# EAGLE design motordriver (EAGLE 6.5.0)
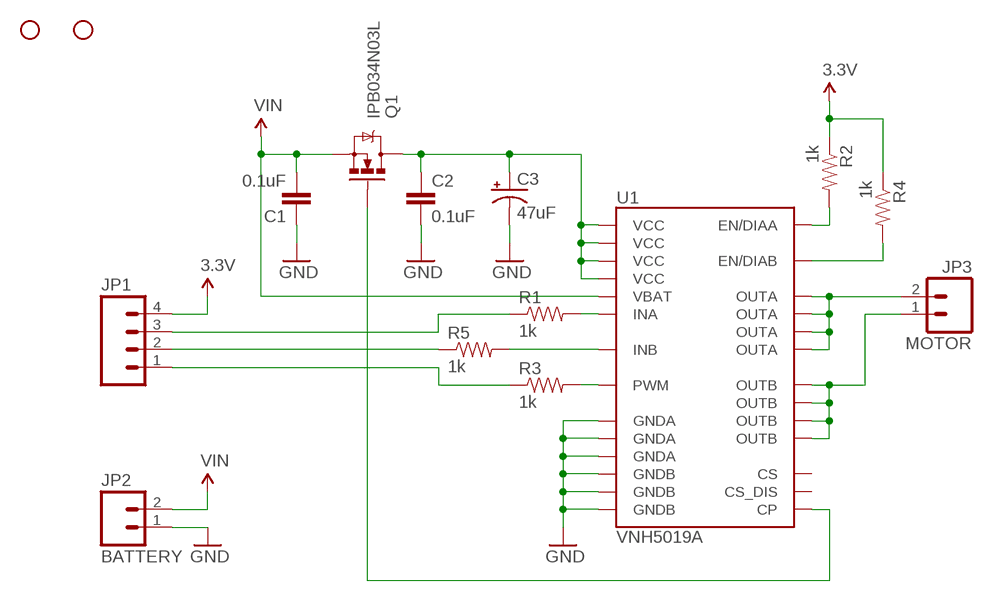
[diagram p0: schematic, sheet 1]

## Parts
C1  0.1uF  CAP0805  [0805]
C2  0.1uF  CAP0805  [0805]
C3  47uF  CAP_POLPTH1  [CPOL-RADIAL-100UF-25V]
JP1  M04POLAR_LOCK  [MOLEX-1X4_LOCK]
JP2  BATTERY  M025MM  [SCREWTERMINAL-5MM-2]
JP3  MOTOR  M025MM  [SCREWTERMINAL-5MM-2]
Q1  IPB034N03L  MOSFET-NCHANNELFDD8780  [DPAK]
R1  1k  RESISTOR0805-RES  [0805]
R2  1k  RESISTOR0805-RES  [0805]
R3  1k  RESISTOR0805-RES  [0805]
R4  1k  RESISTOR0805-RES  [0805]
R5  1k  RESISTOR0805-RES  [0805]
STANDOFF1  STAND-OFF  [STAND-OFF]
STANDOFF2  STAND-OFF  [STAND-OFF]
U1  VNH5019A  [MULTIPOWERSO-30]

## Nets
3.3V: JP1.4 R2.1 R4.1
GND: C1.1 C2.2 C3.2(-) JP2.1 U1.18(GNDB) U1.19(GNDB) U1.20(GNDB) U1.26(GNDA) U1.27(GNDA) U1.28(GNDA)
N$1: R1.2 U1.4(INA)
N$2: R5.2 U1.10(INB)
N$3: R3.2 U1.7(PWM)
N$4: Q1.1(G) U1.11(CP)
N$5: JP1.2 R5.1
N$7: JP1.3 R1.1
N$8: JP1.1 R3.1
N$9: R2.2 U1.5(EN/DIAA)
N$11: R4.2 U1.9(EN/DIAB)
OUTA: JP3.2 U1.1(OUTA) U1.25(OUTA) U1.30(OUTA) U1.SLUG3(OUTA)
OUTB: JP3.1 U1.15(OUTB) U1.16(OUTB) U1.21(OUTB) U1.SLUG2(OUTB)
VCC: C2.1 C3.1(+) Q1.4(D) U1.3(VCC) U1.13(VCC) U1.23(VCC) U1.SLUG1(VCC)
VIN: C1.2 JP2.2 Q1.3(S) U1.12(VBAT)
Unconnected: U1.6(CS_DIS) U1.8(CS)

## Library data of the parts
C1 C2 = SparkFun-Capacitors:CAP: Capacitor Standard 0603 ceramic capacitor, and 0.1" leaded capacitor.
C3 = SparkFun-Capacitors:CAP_POL: Capacitor Polarized These are standard SMD and PTH capacitors. Normally 10uF, 47uF, and 100uF in electrolytic and tantalum varieties. Always verify the external diameter of the through hole cap, it varies with capacity, voltage, and manufacturer. The EIA devices should be standard.
JP1 = SparkFun-Connectors:M04: Header 4 Standard 4-pin 0.1" header. Use with straight break away headers (SKU : PRT-00116), right angle break away headers (PRT-00553), swiss pins (PRT-00743), machine pins (PRT-00117), and female headers (PRT-00115). Molex polarized connector foot print use with SKU : PRT-08231 with associated crimp pins and housings. 1MM SMD Version SKU: PRT-10208
JP2 JP3 = SparkFun-Connectors:M02: Standard 2-pin 0.1" header. Use with - straight break away headers ( PRT-00116) - right angle break away headers (PRT-00553) - swiss pins (PRT-00743) - machine pins (PRT-00117) - female headers (PRT-00115) Molex polarized connector foot print use with: PRT-08233 with associated crimp pins and housings. 2.54_SCREWTERM for use with PRT-10571. 3.5mm Screw Terminal footprints for PRT-08084 5mm Screw Terminal footprints for use with PRT-08433
Q1 = SparkFun-DiscreteSemi:MOSFET-NCHANNEL: Common NMOSFET Parts MFG P/N Store ID Prod ID FDD8780 TRANS-09984 SI7820DN TRANS-11055 FDS6630A IC-08089 2N7002PW TRANS-11151 FQP30N06L COM-10213 TRANS-10060 BSS123LT1G TRANS-08345 BSS138 TRANS-00830 BS170 2N7000; PROD_ID: TRANS-09984
R1-R5 = SparkFun-Resistors:RESISTOR: Resistor Basic schematic elements and footprints for 0603, 1206, and PTH resistors.
STANDOFF1 STANDOFF2 = SparkFun-Electromechanical:STAND-OFF: #4 Stand Off This is the mechanical footprint for a #4 phillips button head screw. Use the keepout ring to avoid running the screw head into surrounding components. SKU : PRT-00447
U1 = Custom:VNH5019A

## Board
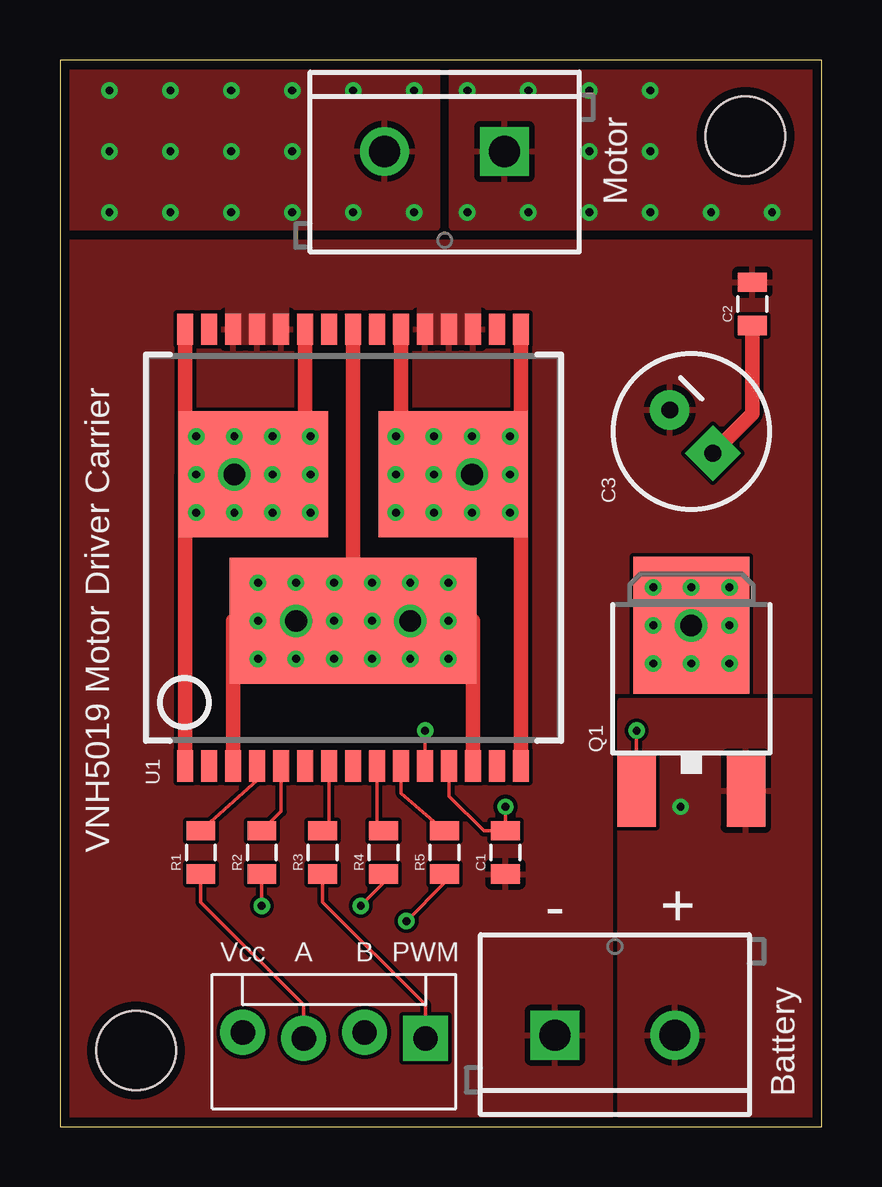
[diagram p1: board, top side]
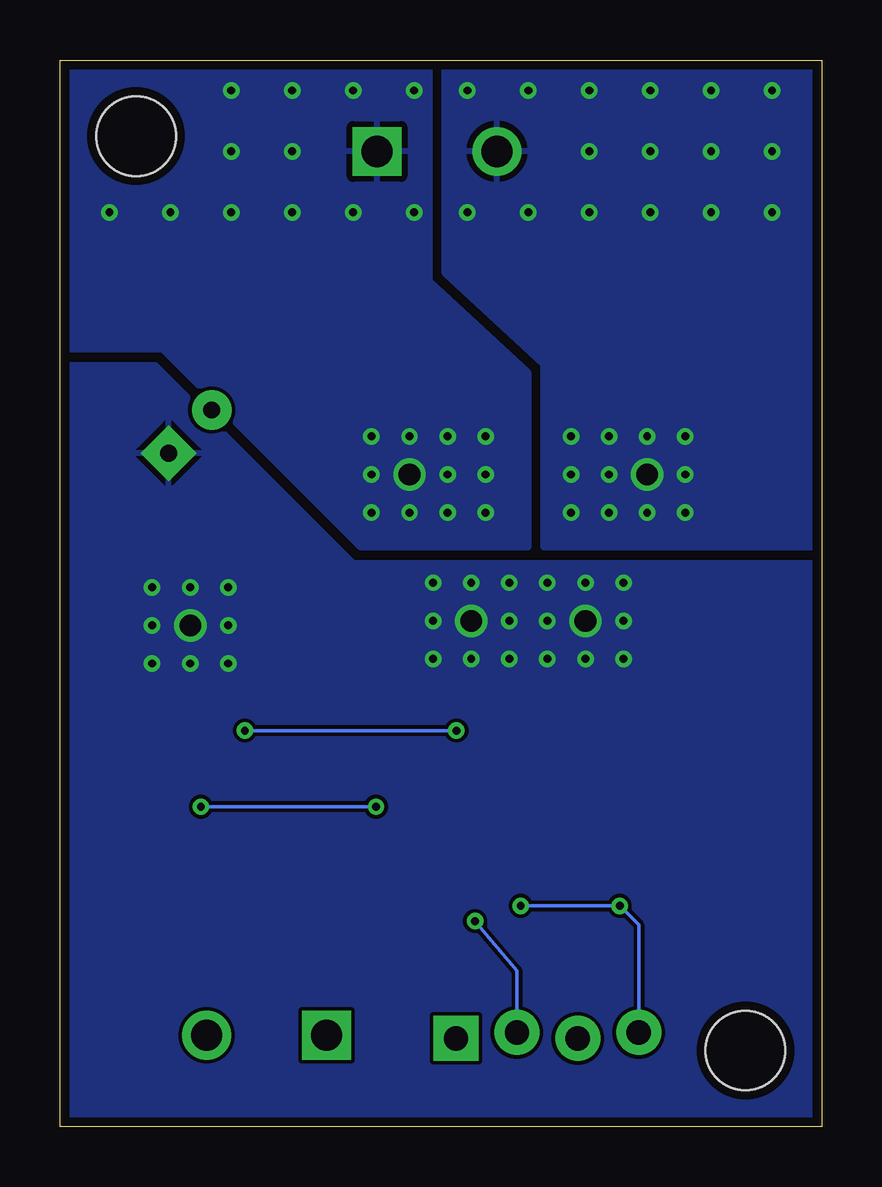
[diagram p2: board, bottom side, seen from below]

Size 31.75 x 44.45 mm. Coordinates in mm from the lower left corner, seen from the top.
Outline: 0,0 31.75,0 31.75,44.45 0,44.45 0,0
Copper layers (1*16): Top 0.0356mm / dielectric 1.5011mm / Bottom 0.0356mm
Design rules "LaenPCBOrder": minimum track width 6mil, minimum drill 13mil, track to track 6mil, track to pad 6mil, pad to pad 6mil, via to via 6mil, smd to smd 6mil, copper to edge 15mil, drill to drill 6mil, minimum pad ring 7mil, minimum via ring 7mil, stop-mask expansion 3mil, vias tented up to drill 0mil, thermal gap 10mil

### Footprints (pad centres in the part's own frame; a part is rotated, then mirrored left to right if it is on the bottom)
0805 = smd 0.8 x 1.2: 1 -0.9,0; 2 0.9,0
CPOL-RADIAL-100UF-25V = drill 0.7 pad 1.651 square: 1 1.27,0 | drill 0.7 pad 1.651: 2 -1.27,0
MOLEX-1X4_LOCK = drill 1.016 pad 1.88 square: 1 0,0.127 | drill 1.016 pad 1.88: 2 2.54,-0.127; 3 5.08,0.127; 4 7.62,-0.127
SCREWTERMINAL-5MM-2 = drill 1.3 pad 2.032 square: 1 0,0 | drill 1.3 pad 2.032: 2 5,0
DPAK = smd 1.6 x 3: 1 -2.28,-5.31; 3 2.28,-5.31 | smd 4.826 x 5.715: 4 0,1.588
STAND-OFF = hole 3.302: 0,0
MULTIPOWERSO-30 = smd 0.67 x 1.3: 1 -7,-9.1; 2 -6,-9.1; 3 -5,-9.1; 4 -4,-9.1; 5 -3,-9.1; 6 -2,-9.1; 7 -1,-9.1; 8 0,-9.1; 9 1,-9.1; 10 2,-9.1; 11 3,-9.1; 12 4,-9.1; 13 5,-9.1; 14 6,-9.1; 15 7,-9.1; 16 7,9.1; 17 6,9.1; 18 5,9.1; 19 4,9.1; 20 3,9.1; 21 2,9.1; 22 1,9.1; 23 0,9.1; 24 -1,9.1; 25 -2,9.1; 26 -3,9.1; 27 -4,9.1; 28 -5,9.1; 29 -6,9.1; 30 -7,9.1 | smd 10.3 x 5.25: SLUG1 0,-3.05 | smd 6.23 x 5.25: SLUG2 4.165,3.05; SLUG3 -4.165,3.05

### Placement (x,y rotation side)
C1  18.57,11.43 90 top
C2  28.86,34.29 90 top
C3  26.32,28.97 315 top
JP1  15.24,3.81 180 top
JP2  20.64,3.81 0 top
JP3  18.54,40.64 180 top
Q1  26.32,19.3 0 top
R1  5.87,11.43 90 top
R2  8.41,11.43 90 top
R3  10.95,11.43 90 top
R4  13.49,11.43 90 top
R5  16.03,11.43 90 top
STANDOFF1  3.17,3.17 0 top
STANDOFF2  28.57,41.27 0 top
U1  12.22,24.13 0 top

### Tracks (layer width: path | path; a pad name or v marks a point on that pad's centre or on a via)
3.3V  (via drill 0.33)
  Top 0.152: v8.41,9.21 R2.1 | R4.1 13.49,10.16 v12.54,9.21
  Bottom 0.152: v12.54,9.21 v8.41,9.21 7.62,8.41 JP1.4
GND
  pour Top: 0,0 22.96,0 22.96,18.16 31.75,18.16 31.75,36.83 0,36.83
  pour Top (no thermals): 6.89,32.58 9.56,32.58 9.56,34.29 6.89,34.29
  pour Top (no thermals): 14.89,32.58 17.56,32.58 17.56,34.29 14.89,34.29
N$1
  Top 0.152: R1.2 8.22,14.43 U1.4
N$2
  Top 0.152: R5.2 14.22,13.89 U1.10
N$3
  Top 0.152: R3.2 11.22,12.35 U1.7
N$4  (via drill 0.33)
  Top 0.152: U1.11 v15.22,16.51 | v24.04,16.51 Q1.1
  Bottom 0.152: v15.22,16.51 v24.04,16.51
N$5  (via drill 0.33)
  Top 0.152: v14.45,8.57 16.03,10.16 R5.1
  Bottom 0.152: v14.45,8.57 12.7,6.51 JP1.2
N$7
  Top 0.152: R1.1 5.87,9.37 10.16,5.08 JP1.3
N$8
  Top 0.152: R3.1 10.95,9.37 15.24,5.08 JP1.1
N$9
  Top 0.152: R2.2 9.22,13.14 U1.5
N$11
  Top 0.152: R4.2 13.22,12.6 U1.9
OUTA  (via drill 0.33, 0.9)
  Top 0.152: v7.27,27.18 7.27,27.05 U1.SLUG3
  Top 0.61: U1.25 10.22,29.34 U1.SLUG3 5.22,27.18 | U1.1 5.22,27.18 | U1.30 5.22,27.18
  other vias: 4.6,40.64 9.68,40.64 7.14,38.1 2.06,38.1 2.06,43.18 7.14,43.18 12.22,38.1 12.22,43.18 2.06,40.64 4.6,43.18 4.6,38.1 7.14,40.64 9.68,43.18 9.68,38.1 14.76,38.1 14.76,43.18 5.68,28.77 5.68,27.18 5.68,25.59 7.27,25.59 8.86,25.59 10.45,25.59 7.27,28.77 8.86,28.77 10.45,28.77 8.86,27.18 10.45,27.18
  pour Bottom: 0,24.13 11.59,24.13 11.59,31.75 15.72,35.56 15.72,44.45 0,44.45
  pour Top: 0,44.45 15.72,44.45 15.72,37.47 0,37.47
OUTB  (via drill 0.33, 0.9)
  Top 0.152: U1.16 19.22,28.77 v18.76,28.77 | v14,28.77 14,29.34 14.22,29.34
  Top 0.61: U1.16 U1.15 | U1.21 14.22,29.34 U1.SLUG2
  other vias: 22.07,40.64 29.69,38.1 24.61,38.1 24.61,43.18 19.53,43.18 19.53,38.1 16.99,43.18 16.99,38.1 22.07,38.1 22.07,43.18 24.61,40.64 27.15,38.1 14,27.18 14,25.59 15.59,25.59 15.59,27.18 15.59,28.77 17.18,28.77 17.18,27.18 17.18,25.59 18.76,25.59 18.76,27.18
  pour Bottom: 12.22,24.13 19.21,24.13 27.46,32.38 31.75,32.38 31.75,44.45 16.35,44.45 16.35,35.24 12.22,31.43
  pour Top: 31.75,44.45 31.75,37.47 16.35,37.47 16.35,44.45
VCC  (via drill 0.33, 0.9)
  Top 0.152: v13.02,21.08 13.02,21.59 12.22,21.59 | Q1.4 26.32,20.32 26.83,20.32 26.83,20.89 Q1.4
  Top 0.61: U1.3 7.22,21.08 U1.SLUG1 | U1.SLUG1 12.22,21.59 U1.23 | U1.SLUG1 17.22,21.08 U1.13 | C2.1 28.86,29.71 C3.1
  other vias: 13.02,22.67 11.43,22.67 14.61,22.67 16.19,22.67 9.84,22.67 8.26,22.67 8.26,21.08 9.84,21.08 8.26,19.49 9.84,19.49 11.43,19.49 11.43,21.08 13.02,19.49 14.61,21.08 16.19,21.08 14.61,19.49 16.19,19.49 26.32,19.3 24.73,19.3 27.91,19.3 27.91,20.89 26.32,20.89 24.73,20.89 24.73,22.48 26.32,22.48 27.91,22.48
  pour Bottom: 0,0 31.75,0 31.75,31.75 27.78,31.75 19.53,23.5 0,23.5
VIN  (via drill 0.33)
  Top 0.152: 16.03,15.24 16.22,15.05 U1.12 16.22,13.78 17.67,12.33 C1.2 v18.57,13.34
  Bottom 0.152: v18.57,13.34 v25.88,13.34
  pour Top: 31.75,0 23.37,0 23.37,17.75 31.75,17.75

### Text on the board
tPlace: Motor | VNH5019 Motor Driver Carrier | - | + | Vcc | A | B | PWM | Battery